# Altium schematic sheet ngh-audio.SchDoc
size A4
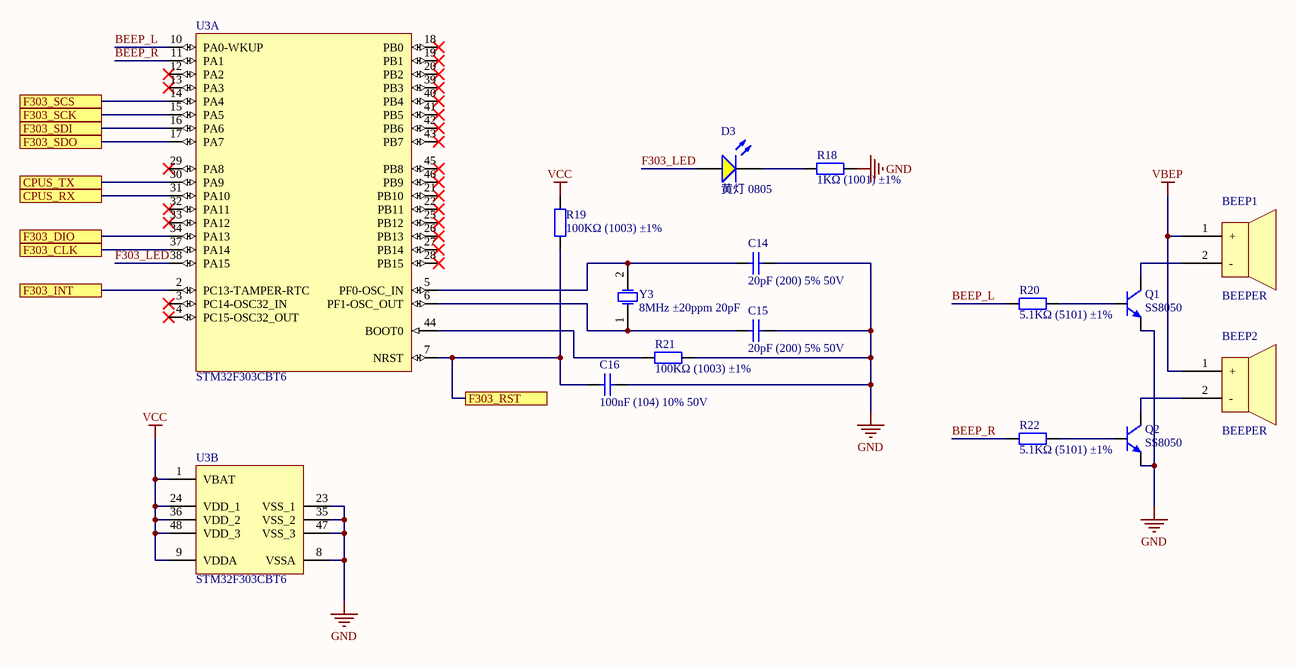
[diagram p0: ngh-audio.SchDoc]

## Parts
BEEP1  BEEPER  [BEEPER]
BEEP2  BEEPER  [BEEPER]
C14  20pF (200) 5% 50V  [0603_C]
C15  20pF (200) 5% 50V  [0603_C]
C16  100nF (104) 10% 50V  [0603_C]
D3  黄灯 0805  [0805_LED_S1]
Q1  SS8050  [SOT23-3M]
Q2  SS8050  [SOT23-3M]
R18  1KΩ (1001) ±1%  [0603_R]
R19  100KΩ (1003) ±1%  [0603_R]
R20  5.1KΩ (5101) ±1%  [0603_R]
R21  100KΩ (1003) ±1%  [0603_R]
R22  5.1KΩ (5101) ±1%  [0603_R]
U3  STM32F303CBT6  [LQFP-48_7x7x05P]  (parts A,B of 2)
Y3  8MHz ±20ppm 20pF  [SMD-5032_2P]

## Ports
CPUS_RX, CPUS_TX, F303_CLK, F303_DIO, F303_INT, F303_RST, F303_SCK, F303_SCS, F303_SDI, F303_SDO

## Nets
GND: C14.2 C15.2 C16.1 Q1.2(E) Q2.2(E) R18.2 R21.2 U3.8(VSSA) U3.23(VSS_1) U3.35(VSS_2) U3.47(VSS_3)
VBEP: BEEP1.1(+) BEEP2.1(+)
VCC: R19.2 U3.1(VBAT) U3.9(VDDA) U3.24(VDD_1) U3.36(VDD_2) U3.48(VDD_3)
BEEP_L: R20.1 U3.10(PA0-WKUP)
BEEP_R: R22.1 U3.11(PA1)
CPUS_RX: U3.31(PA10) ; port CPUS_RX
CPUS_TX: U3.30(PA9) ; port CPUS_TX
F303_CLK: U3.37(PA14) ; port F303_CLK
F303_DIO: U3.34(PA13) ; port F303_DIO
F303_INT: U3.2(PC13-TAMPER-RTC) ; port F303_INT
F303_LED: D3.A U3.38(PA15)
F303_RST: C16.2 R19.1 U3.7(NRST) ; port F303_RST
F303_SCK: U3.15(PA5) ; port F303_SCK
F303_SCS: U3.14(PA4) ; port F303_SCS
F303_SDI: U3.16(PA6) ; port F303_SDI
F303_SDO: U3.17(PA7) ; port F303_SDO
NetBEEP1_2: BEEP1.2(-) Q1.3(C)
NetBEEP2_2: BEEP2.2(-) Q2.3(C)
NetC14_1: C14.1 U3.5(PF0-OSC_IN) Y3.2(OSC2)
NetC15_1: C15.1 U3.6(PF1-OSC_OUT) Y3.1(OSC1)
NetD3_K: D3.K R18.1
NetQ1_1: Q1.1(B) R20.2
NetQ2_1: Q2.1(B) R22.2
NetR21_1: R21.1 U3.44(BOOT0)

Not connected (* = marked no-connect by the designer): U3 3(PC14-OSC32_IN)* 4(PC15-OSC32_OUT)* 12(PA2)* 13(PA3)* 18(PB0)* 19(PB1)* 20(PB2)* 21(PB10)* 22(PB11)* 25(PB12)* 26(PB13)* 27(PB14)* 28(PB15)* 29(PA8)* 32(PA11)* 33(PA12)* 39(PB3)* 40(PB4)* 41(PB5)* 42(PB6)* 43(PB7)* 45(PB8)* 46(PB9)*

## Library data of the parts
C14 C15 = 0603 20pF (200) 5% 50V: 贴片电容; ComponentLink1Description: 供应商链接; ComponentLink1URL: http://www.szlcsc.com/product/details_2000.html; Package: 0603; Supplier: LC; SuppliersPartNumber: C1648
C16 = 0603 100nF (104) 10% 50V: 贴片电容; ComponentLink1Description: 供应商链接; ComponentLink1URL: http://www.szlcsc.com/product/details_15331.html; Package: 0603; Supplier: LC; SuppliersPartNumber: C14663
D3 = 0805 黄灯: 发光二极管; ComponentLink1Description: 供应商链接; ComponentLink1URL: http://www.szlcsc.com/product/details_2669.html; Package: 0805; Supplier: LC; SuppliersPartNumber: C2296
Q1 Q2 = 8050-SMD: 高频放大-NPN型; 版权归属: 源创客; 属性: 40V 1.5A 1W 100MHZ; BOM名称: 高频放大-NPN型; 学习资源: www.ooocke.com
R18 = 0603 1KΩ (1001) 1%: 贴片电阻; ComponentLink1Description: 供应商链接; ComponentLink1URL: http://www.szlcsc.com/product/details_21904.html; Package: 0603; Supplier: LC; SuppliersPartNumber: C21190
R19 R21 = 0603 100KΩ (1003) 1%: 贴片电阻; ComponentLink1Description: 供应商链接; ComponentLink1URL: http://www.szlcsc.com/product/details_26546.html; Package: 0603; Supplier: LC; SuppliersPartNumber: C25803
R20 R22 = 0603 5.1KΩ (5101) 1%: 贴片电阻; ComponentLink1Description: 供应商链接; ComponentLink1URL: http://www.szlcsc.com/product/details_23913.html; Package: 0603; Supplier: LC; SuppliersPartNumber: C23186
U3 = STM32F303CBT6: ARM; ComponentLink1Description: 供应商链接; ComponentLink1URL: http://www.szlcsc.com/product/details_9243.html; Package: LQFP-48_7x7x05P; Supplier: LC; SuppliersPartNumber: C8734
Y3 = SMD-5032_2P 8MHz 20ppm 20pF: 贴片晶振; ComponentLink1Description: 供应商链接; ComponentLink1URL: http://www.szlcsc.com/product/details_117214.html; Package: SMD-5032_2P; Supplier: LC; SuppliersPartNumber: C115962